# EAGLE design rfidreceiver (EAGLE 7.5.0)
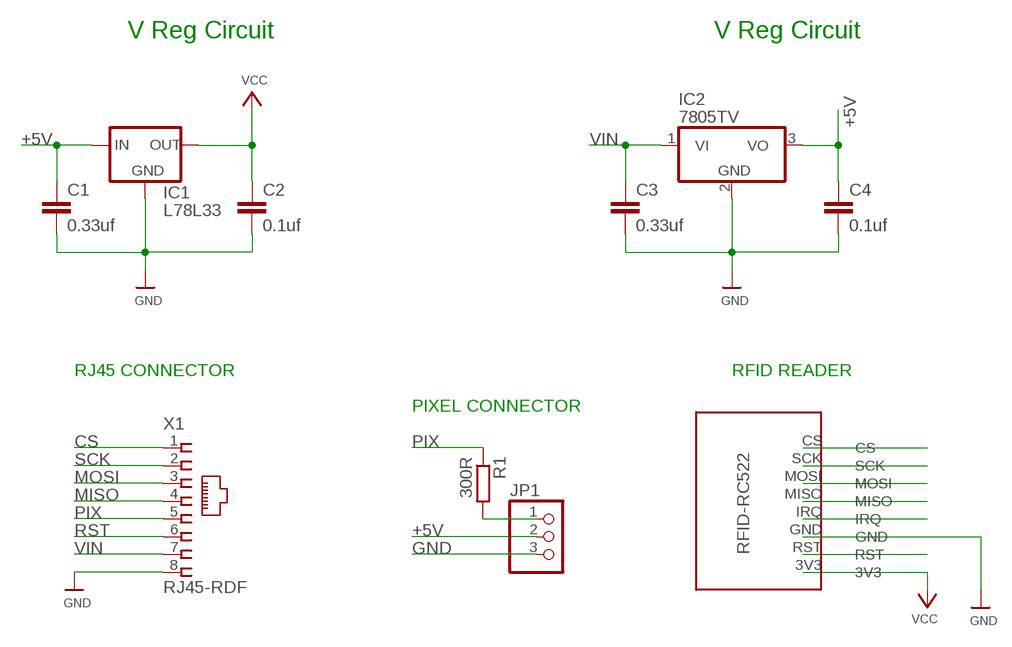
[diagram p0: schematic, sheet 1]

## Parts
C1  0.33uf  C-EU050-024X044  [C050-024X044]
C2  0.1uf  C-EU050-024X044  [C050-024X044]
C3  0.33uf  C-EU050-024X044  [C050-024X044]
C4  0.1uf  C-EU050-024X044  [C050-024X044]
IC1  L78L33  MCP1700L78L33PINS  [TO92-INLINE]
IC2  7805TV  [TO220V]
JP1  PINHD-1X3CB  [1X03-CLEANBIG]
R1  300R  R-EU_0204/5  [0204/5]
U$2  RFID-RC522  [RFID-RC522]
X1  RJ45-RDF  [RJ45-RDF]

## Nets
+5V: C1.1 C4.1 IC1.1(IN) IC2.3(VO) JP1.2
CS: U$2.CS X1.1
GND: C1.2 C2.2 C3.2 C4.2 IC1.2(GND) IC2.2(GND) JP1.3 U$2.GND X1.8
IRQ: U$2.IRQ
MISO: U$2.MISO X1.4
MOSI: U$2.MOSI X1.3
N$2: JP1.1 R1.2
PIX: R1.1 X1.5
RST: U$2.RST X1.6
SCK: U$2.SCK X1.2
VCC: C2.1 IC1.3(OUT) U$2.3V3
VIN: C3.1 IC2.1(VI) X1.7

## Notes on the sheet
- V Reg Circuit | V Reg Circuit
- RJ45 CONNECTOR | RFID READER
- PIXEL CONNECTOR

## Library data of the parts
C1-C4 = rcl:C-EU: CAPACITOR, European symbol
IC1 = adafruit:MCP1700: VOLTAGE REGULATOR
IC2 = linear:78*: Positive VOLTAGE REGULATOR Source: http://cache.national.com/ds/LM/LM78L05.pdf http://www.fairchildsemi.com/ds/LM/LM7805.pdf
JP1 = adafruit:PINHD-1X3: PIN HEADER
R1 = rcl:R-EU_: RESISTOR, European symbol
U$2 = Rdf:RFID-RC522
X1 = con-tycoelectronics:RJ45-RDF

## Board
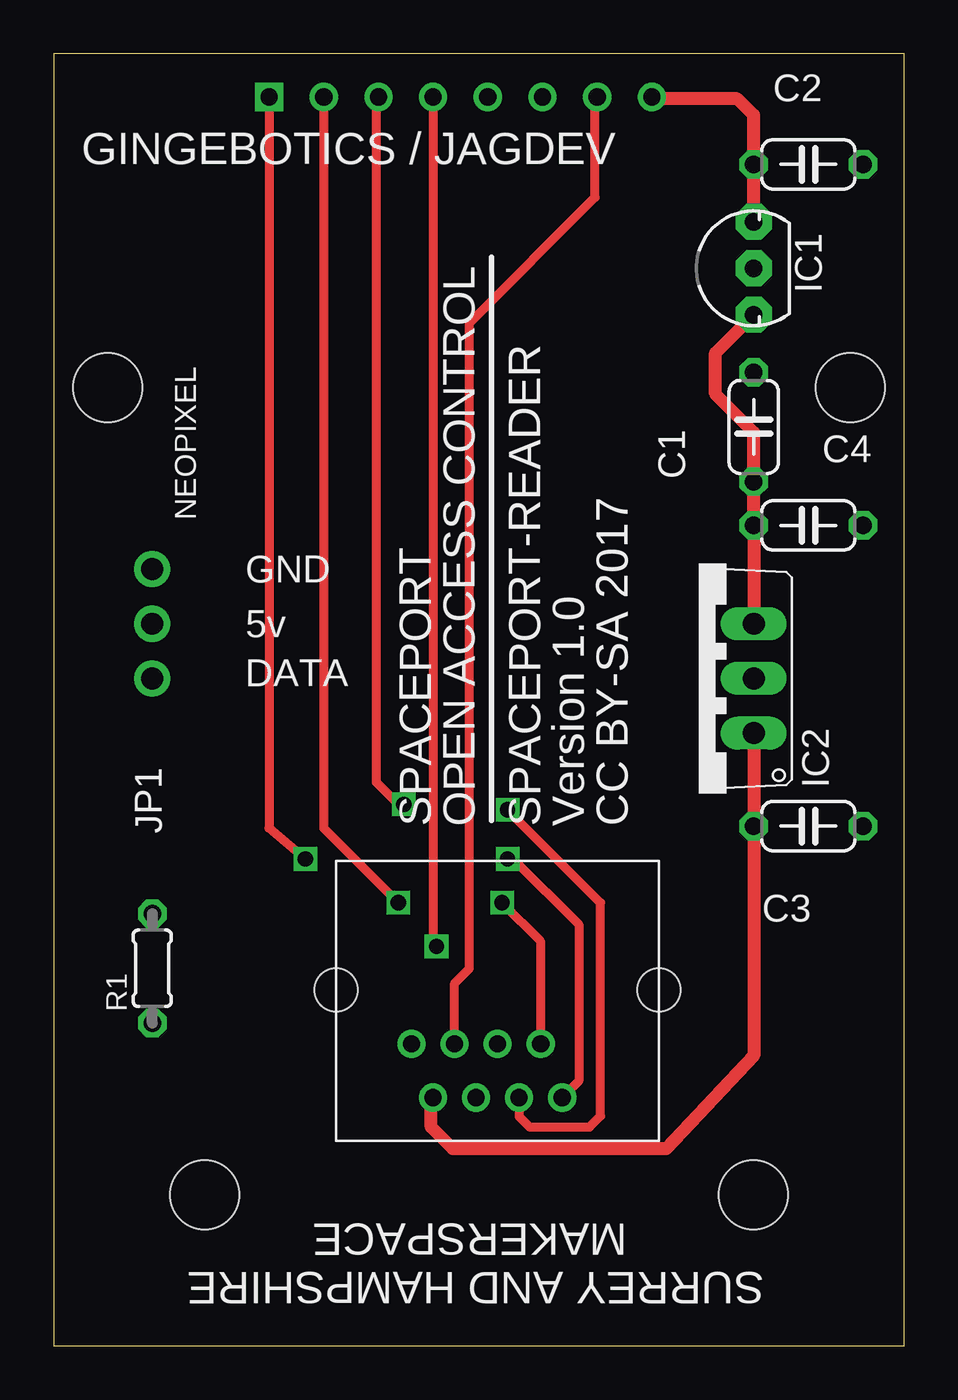
[diagram p1: board, top side]
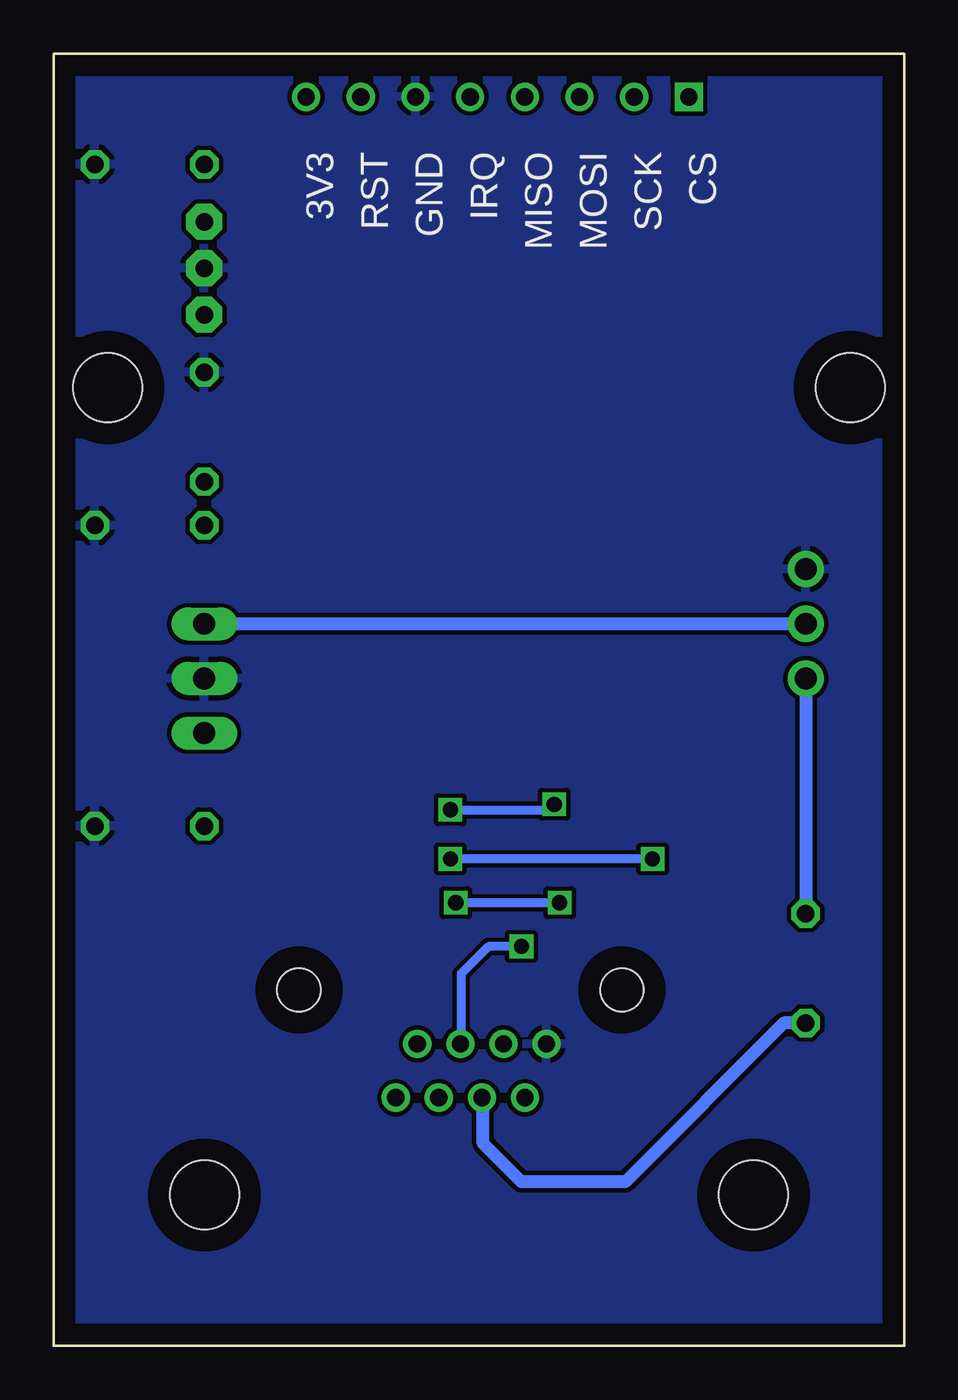
[diagram p2: board, bottom side, seen from below]

Size 39.5 x 60 mm. Coordinates in mm from the lower left corner, seen from the top.
Outline: 0,0 39.5,0 39.5,60 0,60 0,0
Copper layers (1*16): Top 0.035mm / dielectric 1.5mm / Bottom 0.035mm
Design rules "default *": minimum track width 10mil, minimum drill 24mil, track to track 8mil, track to pad 8mil, pad to pad 8mil, via to via 8mil, smd to smd 8mil, copper to edge 40mil, drill to drill 8mil, minimum pad ring 10mil, minimum via ring 8mil, stop-mask expansion 4mil, vias tented up to drill 28mil, thermal gap 10mil

### Footprints (pad centres in the part's own frame; a part is rotated, then mirrored left to right if it is on the bottom)
C050-024X044 = drill 0.813 octagon: 1 -2.54,0; 2 2.54,0
TO92-INLINE = drill 0.813 pad 1.676 octagon: 1 -2.159,0; 2 0,0; 3 2.159,0
TO220V = drill 1.016 long: 1 -2.54,-2.54; 2 0,-2.54; 3 2.54,-2.54
1X03-CLEANBIG = drill 1.016 pad 1.676: 1 -2.54,0; 2 0,0; 3 2.54,0
0204/5 = drill 0.813 octagon: 1 -2.54,0; 2 2.54,0
RFID-RC522 = drill 0.8: 3V3 0,-17.78; GND 0,-12.7; IRQ 0,-10.16; MISO 0,-7.62; MOSI 0,-5.08; RST 0,-15.24; SCK 0,-2.54 | drill 0.8 square: CS 0,0 | hole 3.2: 13.5,7.5; 13.5,-27; 51,-22.5; 51,3
RJ45-RDF = drill 0.8: 1 -0.5,2; 2 0.5,-0.5; 3 1.5,2; 4 2.5,-0.5; 5 3.5,2; 6 4.5,-0.5; 7 5.5,2; 8 6.5,-0.5 | hole 2: -5,-3; 10,-3

### Placement (x,y rotation side)
C1  32.51,42.67 90 top
C2  35.05,54.86 0 top
C3  35.05,24.13 0 top
C4  35.05,38.1 0 top
IC1  32.51,50.04 90 top
IC2  29.97,30.99 90 top
JP1  4.57,33.53 90 top
R1  4.57,17.53 90 top
U$2  10,58 270 bottom
X1  23.11,13.52 180 top

### Tracks (layer width: path | path; a pad name or v marks a point on that pad's centre or on a via)
+5V
  Top 0.61: IC1.1 30.73,46.1 30.73,44.2 32.51,42.42 C1.1 C4.1 IC2.3
  Bottom 0.61: JP1.2 IC2.3
CS  (via drill 0.7)
  Top 0.406: U$2.CS 10,24.04 v11.68,22.61 | v21.08,22.61 21.34,22.61 24.38,19.56 24.38,12.29 X1.1
  Bottom 0.406: v11.68,22.61 v21.08,22.61
GND
  pour Bottom: 0,60.2 39.37,60.2 39.37,59.94 39.37,0 0,0
MISO  (via drill 0.7)
  Top 0.406: U$2.MISO 17.62,18.7 v17.78,18.54
  Bottom 0.406: v17.78,18.54 19.3,18.54 20.57,17.27 20.57,14.06 X1.4
MOSI  (via drill 0.7)
  Top 0.406: X1.3 21.61,10.64 22.1,10.16 24.89,10.16 25.4,10.67 25.4,20.57 v21.08,24.89 | v16.26,25.15 16,25.15 14.99,26.16 14.99,57.91 U$2.MOSI
  Bottom 0.406: v21.08,24.89 16.51,24.89 v16.26,25.15
N$2
  Bottom 0.61: JP1.1 R1.2
PIX
  Bottom 0.61: R1.1 5.59,14.99 12.95,7.62 17.78,7.62 19.56,9.4 19.56,11.46 X1.5
RST
  Top 0.406: U$2.RST 25.15,57.91 25.15,53.34 19.3,47.5 19.3,17.53 18.61,16.84 X1.6
SCK  (via drill 0.7)
  Top 0.406: U$2.SCK 12.54,24.04 v16,20.57 | v20.83,20.57 22.61,18.8 X1.2
  Bottom 0.406: v16,20.57 v20.83,20.57
VCC
  Top 0.61: IC1.3 C2.1 32.51,57.15 31.75,57.91 27.87,57.91 U$2.3V3
VIN
  Top 0.61: IC2.1 C3.1 32.51,13.46 28.45,9.14 18.54,9.14 17.53,10.16 17.53,11.43 X1.7

### Text on the board
tPlace: GINGEBOTICS / JAGDEV | NEOPIXEL | GND | 5v | DATA | SPACEPORT | OPEN ACCESS CONTROL | SPACEPORT-READER | Version 1.0 | CC BY-SA 2017 | SURREY AND HAMPSHIRE / MAKERSPACE